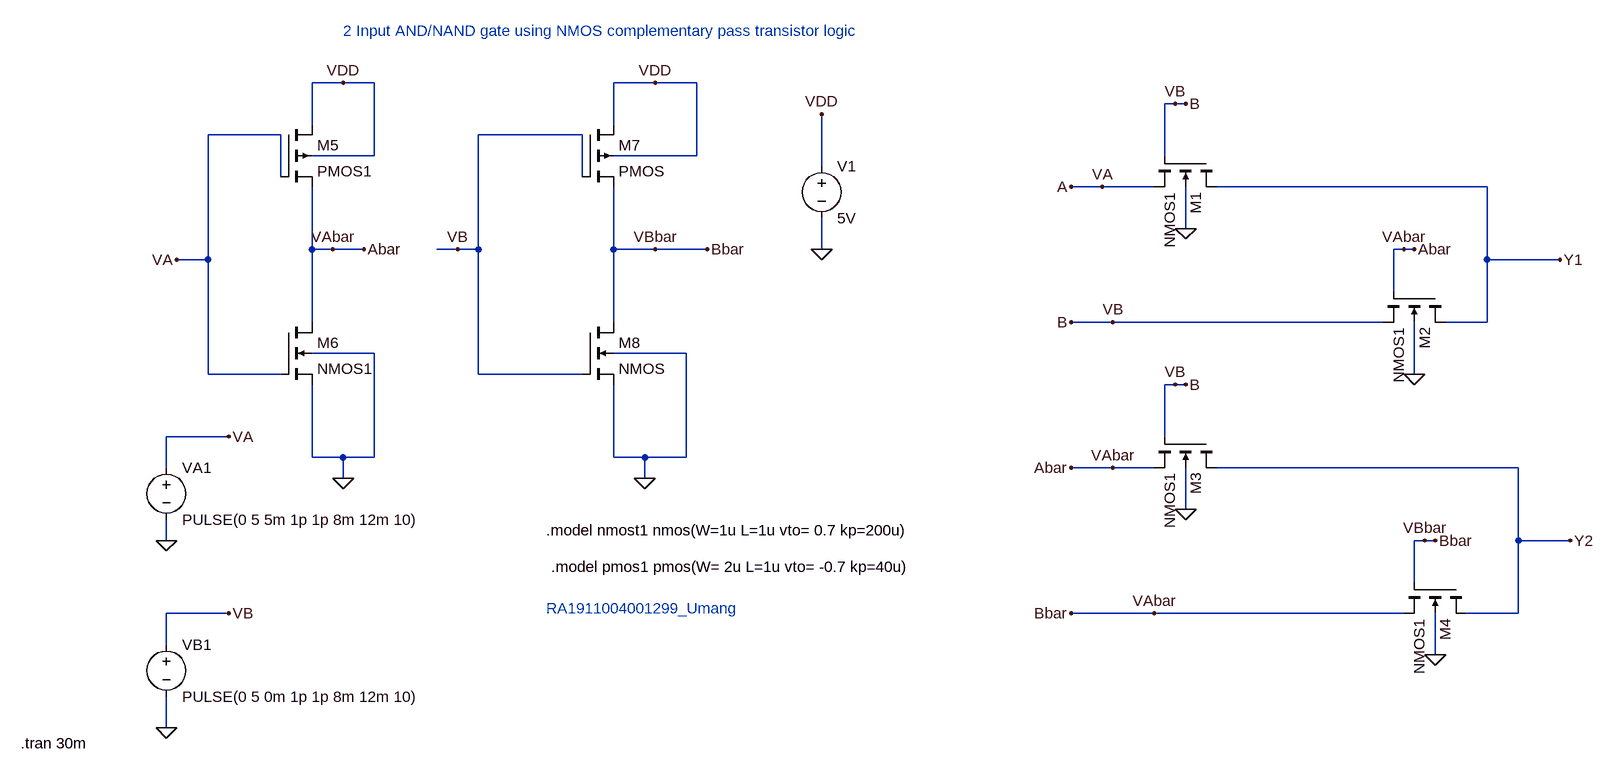
[diagram p0: schematic cpl 2and nand.asc]
cpl 2and nand.asc, the LTspice schematic file:
Version 4
SHEET 1 1952 1112
WIRE 16 -112 -32 -112
WIRE 64 -112 16 -112
WIRE 496 -112 432 -112
WIRE 560 -112 496 -112
WIRE 1296 -80 1280 -80
WIRE 1312 -80 1296 -80
WIRE -32 -48 -32 -112
WIRE 432 -48 432 -112
WIRE -80 -32 -192 -32
WIRE 384 -32 224 -32
WIRE 64 0 64 -112
WIRE 64 0 -32 0
WIRE 560 0 560 -112
WIRE 560 0 432 0
WIRE 1280 0 1280 -80
WIRE 752 16 752 -64
WIRE -80 32 -80 -32
WIRE 384 32 384 -32
WIRE 1184 48 1136 48
WIRE 1264 48 1184 48
WIRE 1776 48 1360 48
WIRE 1312 112 1312 48
WIRE -32 144 -32 48
WIRE 0 144 -32 144
WIRE 48 144 0 144
WIRE 192 144 160 144
WIRE 224 144 224 -32
WIRE 224 144 192 144
WIRE 432 144 432 48
WIRE 496 144 432 144
WIRE 576 144 496 144
WIRE 752 144 752 96
WIRE 1648 144 1632 144
WIRE 1664 144 1648 144
WIRE -192 160 -192 -32
WIRE -192 160 -240 160
WIRE 1776 160 1776 48
WIRE 1888 160 1776 160
WIRE 1632 208 1632 144
WIRE -32 256 -32 144
WIRE 432 256 432 144
WIRE 1200 256 1136 256
WIRE 1616 256 1200 256
WIRE 1776 256 1776 160
WIRE 1776 256 1712 256
WIRE 64 304 -32 304
WIRE 544 304 432 304
WIRE -192 336 -192 160
WIRE -80 336 -192 336
WIRE 224 336 224 144
WIRE 384 336 224 336
WIRE 1664 336 1664 256
WIRE 1296 352 1280 352
WIRE 1312 352 1296 352
WIRE -160 432 -256 432
WIRE 1280 432 1280 352
WIRE -32 464 -32 352
WIRE 16 464 -32 464
WIRE 64 464 64 304
WIRE 64 464 16 464
WIRE 432 464 432 352
WIRE 480 464 432 464
WIRE 544 464 544 304
WIRE 544 464 480 464
WIRE -256 480 -256 432
WIRE 1200 480 1136 480
WIRE 1264 480 1200 480
WIRE 1824 480 1360 480
WIRE 16 496 16 464
WIRE 480 496 480 464
WIRE 1312 544 1312 480
WIRE -256 592 -256 560
WIRE 1680 592 1664 592
WIRE 1696 592 1680 592
WIRE 1824 592 1824 480
WIRE 1904 592 1824 592
WIRE 1664 656 1664 592
WIRE -160 704 -256 704
WIRE 1264 704 1136 704
WIRE 1648 704 1264 704
WIRE 1824 704 1824 592
WIRE 1824 704 1744 704
WIRE -256 752 -256 704
WIRE 1696 768 1696 704
WIRE -256 880 -256 832
FLAG 480 496 0
FLAG 16 496 0
FLAG -240 160 VA
FLAG 0 144 VAbar
FLAG 48 144 Abar
FLAG 496 144 VBbar
FLAG 576 144 Bbar
FLAG 752 144 0
FLAG 752 -64 VDD
FLAG 1312 112 0
FLAG 1664 336 0
FLAG 1312 544 0
FLAG 1696 768 0
FLAG 1200 480 VAbar
FLAG 1264 704 VAbar
FLAG 1136 704 Bbar
FLAG 1136 480 Abar
FLAG 1648 144 VAbar
FLAG 1664 144 Abar
FLAG 1680 592 VBbar
FLAG 1696 592 Bbar
FLAG 1904 592 Y2
FLAG 1888 160 Y1
FLAG 1296 352 VB
FLAG 1312 352 B
FLAG 1200 256 VB
FLAG 1184 48 VA
FLAG 1296 -80 VB
FLAG 1312 -80 B
FLAG 1136 48 A
FLAG 1136 256 B
FLAG -256 592 0
FLAG -256 880 0
FLAG -160 432 VA
FLAG -160 704 VB
FLAG 16 -112 VDD
FLAG 496 -112 VDD
FLAG 192 144 VB
SYMBOL pmos4 -80 -48 R0
SYMATTR InstName M5
SYMATTR Value PMOS1
SYMBOL pmos4 384 -48 R0
SYMATTR InstName M7
SYMBOL nmos4 -80 256 R0
SYMATTR InstName M6
SYMATTR Value NMOS1
SYMBOL nmos4 384 256 R0
SYMATTR InstName M8
SYMBOL voltage 752 0 R0
SYMATTR InstName V1
SYMATTR Value 5V
SYMBOL nmos4 1360 0 R90
SYMATTR InstName M1
SYMATTR Value NMOS1
SYMBOL nmos4 1712 208 R90
SYMATTR InstName M2
SYMATTR Value NMOS1
SYMBOL nmos4 1360 432 R90
SYMATTR InstName M3
SYMATTR Value NMOS1
SYMBOL nmos4 1744 656 R90
SYMATTR InstName M4
SYMATTR Value NMOS1
SYMBOL voltage -256 464 R0
WINDOW 123 0 0 Left 0
WINDOW 39 0 0 Left 0
SYMATTR InstName VA1
SYMATTR Value PULSE(0 5 5m 1p 1p 8m 12m 10)
SYMBOL voltage -256 736 R0
WINDOW 123 0 0 Left 0
WINDOW 39 0 0 Left 0
SYMATTR InstName VB1
SYMATTR Value PULSE(0 5 0m 1p 1p 8m 12m 10)
TEXT 16 -192 Left 2 ;2 Input AND/NAND gate using NMOS complementary pass transistor logic
TEXT -480 904 Left 2 !.tran 30m
TEXT 328 576 Left 2 !.model nmost1 nmos(W=1u L=1u vto= 0.7 kp=200u)
TEXT 336 632 Left 2 !.model pmos1 pmos(W= 2u L=1u vto= -0.7 kp=40u)
TEXT 328 696 Left 2 ;RA1911004001299_Umang

The netlist it stands for:
* cpl 2and nand.asc
M5 VDD A Bbar VDD PMOS1
M7 VDD B Bbar VDD PMOS
M6 Bbar A 0 0 NMOS1
M8 Bbar B 0 0 NMOS
V1 VDD 0 5V
M1 Y1 B A 0 NMOS1
M2 Y1 Bbar B 0 NMOS1
M3 Y2 B Bbar 0 NMOS1
M4 Y2 Bbar Bbar 0 NMOS1
VA1 A 0 PULSE(0 5 5m 1p 1p 8m 12m 10)
VB1 B 0 PULSE(0 5 0m 1p 1p 8m 12m 10)
.model NMOS NMOS
.model PMOS PMOS
.lib standard.mos
* 2 Input AND/NAND gate using NMOS complementary pass transistor logic
.tran 30m
.model nmost1 nmos(W=1u L=1u vto= 0.7 kp=200u)
.model pmos1 pmos(W= 2u L=1u vto= -0.7 kp=40u)
* RA1911004001299_Umang
.backanno
.end